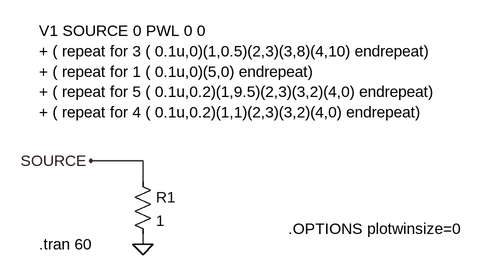
[diagram p0: schematic Fig_2-46_V-source-PWL_Repeat-3.asc]
Fig_2-46_V-source-PWL_Repeat-3.asc, the LTspice schematic file:
Version 4
SHEET 1 1016 680
WIRE 272 80 192 80
WIRE 272 112 272 80
WIRE 272 208 272 192
FLAG 272 208 0
FLAG 192 80 SOURCE
SYMBOL res 256 96 R0
SYMATTR InstName R1
SYMATTR Value 1
TEXT 112 208 Left 2 !.tran 60
TEXT 496 184 Left 2 !.OPTIONS plotwinsize=0
TEXT 112 -120 Left 2 !V1 SOURCE 0 PWL 0 0 \n+ ( repeat for 3 ( 0.1u,0)(1,0.5)(2,3)(3,8)(4,10) endrepeat)\n+ ( repeat for 1 ( 0.1u,0)(5,0) endrepeat)\n+ ( repeat for 5 ( 0.1u,0.2)(1,9.5)(2,3)(3,2)(4,0) endrepeat)\n+ ( repeat for 4 ( 0.1u,0.2)(1,1)(2,3)(3,2)(4,0) endrepeat)

The netlist it stands for:
* Fig_2-46_V-source-PWL_Repeat-3.asc
R1 SOURCE 0 1
.tran 60
.OPTIONS plotwinsize=0
V1 SOURCE 0 PWL 0 0
+ ( repeat for 3 ( 0.1u,0)(1,0.5)(2,3)(3,8)(4,10) endrepeat)
+ ( repeat for 1 ( 0.1u,0)(5,0) endrepeat)
+ ( repeat for 5 ( 0.1u,0.2)(1,9.5)(2,3)(3,2)(4,0) endrepeat)
+ ( repeat for 4 ( 0.1u,0.2)(1,1)(2,3)(3,2)(4,0) endrepeat)
.backanno
.end